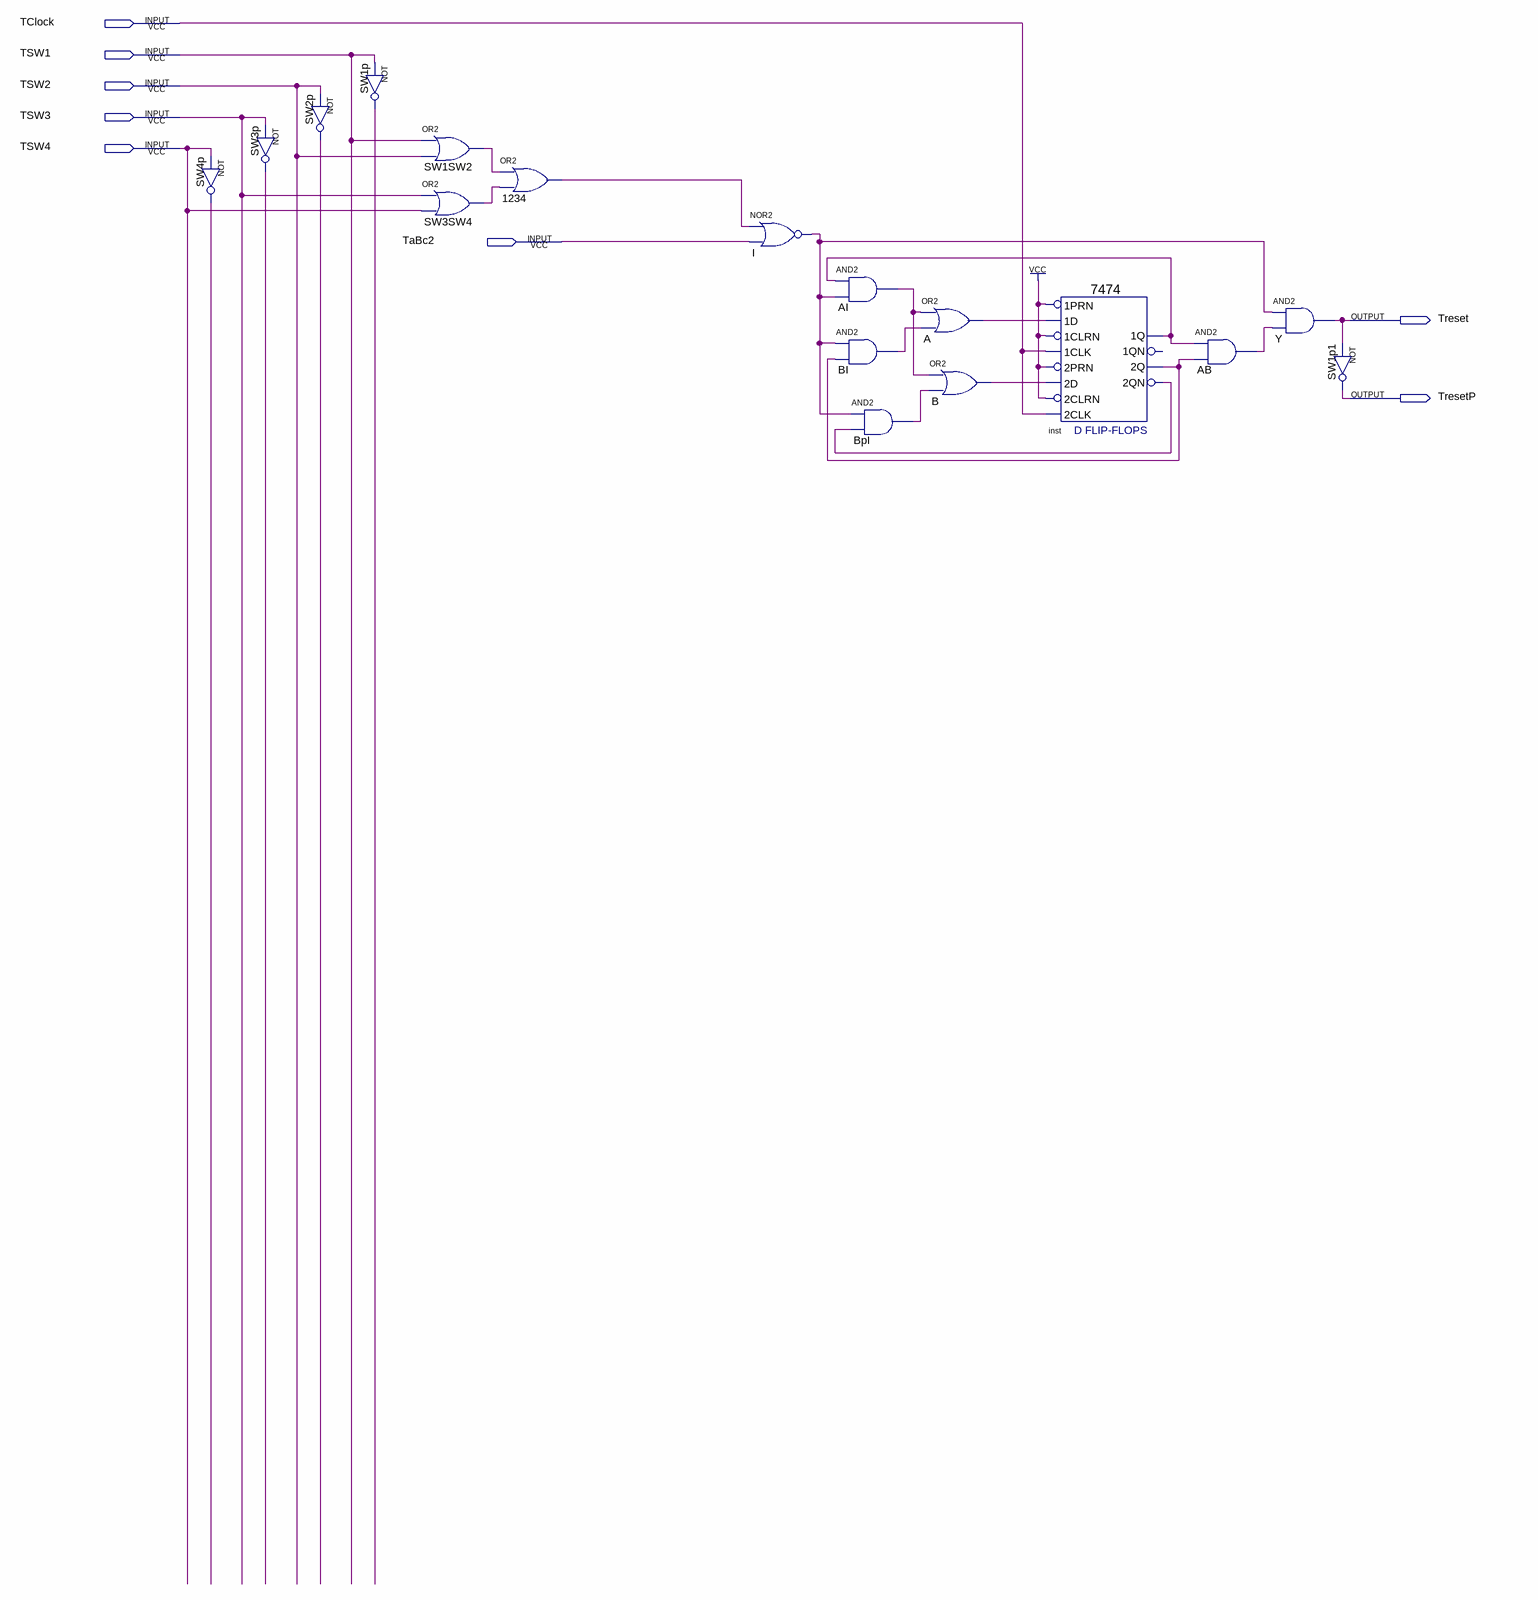
[diagram p0: schematic sheet]
// Quartus schematic Treset.bdf as structural Verilog: 17 symbols, 8 pins
module Treset (
  input  TClock,
  input  TSW1,
  input  TSW2,
  input  TSW3,
  input  TSW4,
  input  TaBc2,
  output Treset,
  output TresetP
);

  wire A_out, AB_out, AI_out, B_out, BI_out, BpI_out, I_out, inst_1q, inst_2q, inst_2qn, n1234_out, SW1p_out,
       SW1SW2_out, SW2p_out, SW3p_out, SW3SW4_out, SW4p_out;

  not SW4p (SW4p_out, TSW4);
  not SW3p (SW3p_out, TSW3);
  not SW2p (SW2p_out, TSW2);
  not SW1p (SW1p_out, TSW1);
  or SW1SW2 (SW1SW2_out, TSW1, TSW2);
  or SW3SW4 (SW3SW4_out, TSW3, TSW4);
  or u_1234 (n1234_out, SW1SW2_out, SW3SW4_out);
  nor I (I_out, n1234_out, TaBc2);
  and AI (AI_out, inst_1q, I_out);
  and BI (BI_out, I_out, inst_2q);
  and BpI (BpI_out, I_out, inst_2qn);
  or A (A_out, AI_out, BI_out);
  or B (B_out, AI_out, BpI_out);
  \7474  inst (
    .\2D (B_out), .\2PRN (1'b1), .\1CLK (TClock), .\1D (A_out), .\1PRN (1'b1), .\2CLK (TClock),
    .\2CLRN (1'b1), .\1CLRN (1'b1), .\2Q (inst_2q), .\2QN (inst_2qn), .\1Q (inst_1q));  // open: 1QN
  and AB (AB_out, inst_1q, inst_2q);
  and Y (Treset, I_out, AB_out);
  not SW1p1 (TresetP, Treset);
endmodule
